# Altium schematic sheet USB Bridge.SchDoc
size B
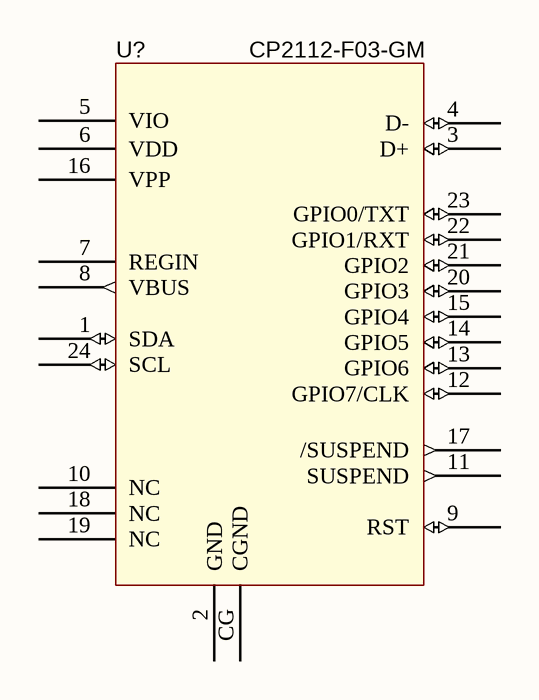
[diagram p0: USB Bridge.SchDoc]

## Parts
U?  CP2112-F03-GM  [QFN50P395X395X80_HS-25N]

## Nets

Not connected (* = marked no-connect by the designer): U? 1(SDA) 2(GND) 3(D+) 4(D-) 5(VIO) 6(VDD) 7(REGIN) 8(VBUS) 9(RST) 10(NC) 11(SUSPEND) 12(GPIO7/CLK) 13(GPIO6) 14(GPIO5) 15(GPIO4) 16(VPP) 17(/SUSPEND) 18(NC) 19(NC) 20(GPIO3) 21(GPIO2) 22(GPIO1/RXT) 23(GPIO0/TXT) 24(SCL) CG(CGND)

## Library data of the parts
U? = CP2112-F03-GM: IC HID USB-TO-SMBUS BRIDGE 24QFN; Manufacturer: Silicon Labs; SymbolCreator: x0208325; U/M: EA; SymbolVersion: 2013-12-26; PartNumber: CP2112-F03-GM; PackageDescription: 24-QFN; MountType: SMT; ComponentLink1Description: Datasheet Link; ComponentLink1URL: http://www.silabs.com/documents/public/data-sheets/cp2112-datasheet.pdf; CompType: IC; RoHS: Y; LatestRevisionDate: 2016-06-17; Supplier 1: Mouser; Supplier 2: Digi-Key; Supplier Part Number 1: 634-CP2112-F02-GM; Supplier Part Number 2: 336-2149-5-ND